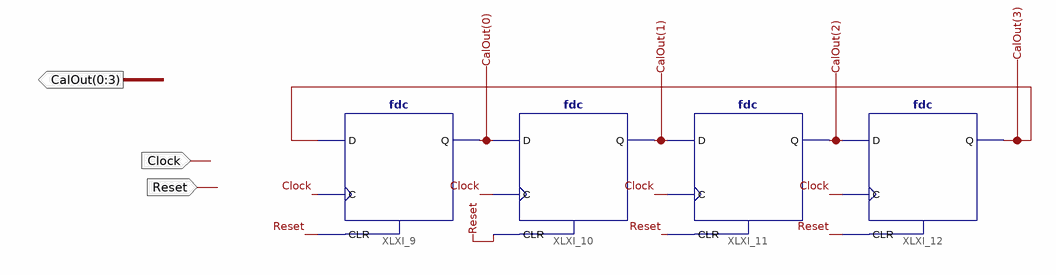
[diagram p0: schematic sheet 1]
// Xilinx ISE schematic dwe_ring.sch (spartan3) as structural Verilog: 4 symbols, 3 ports
module dwe_ring (
  input  Clock,
  input  Reset,
  output [0:3] CalOut
);

  fdc XLXI_9 (.C(Clock), .CLR(Reset), .D(CalOut[3]), .Q(CalOut[0]));
  fdc XLXI_10 (.C(Clock), .CLR(Reset), .D(CalOut[0]), .Q(CalOut[1]));
  fdc XLXI_11 (.C(Clock), .CLR(Reset), .D(CalOut[1]), .Q(CalOut[2]));
  fdc XLXI_12 (.C(Clock), .CLR(Reset), .D(CalOut[2]), .Q(CalOut[3]));
endmodule
